# Altium schematic sheet Main.SchDoc
size A3; PageSetup: Record=PageOptions|CenterHorizontal=True|CenterVertical=True|PrintScale=0.67|XCorrection=1.00|YCorrection=1.00|PrintKind=2|BorderSize=5000000|LeftOffset=0|BottomOffset=0|Orientation=2|PaperLength=2970|PaperWidth=2100|Scale=100|PaperSource=7|PrintQuality=300|MediaType=1|DitherType=2|PrintScaleMode=1|PaperKind=A4|PaperIndex=9; Scale: 1:1; DocumentType: Схема электрическая принципиальная; FirstReferrence: АБВГ.123456.001
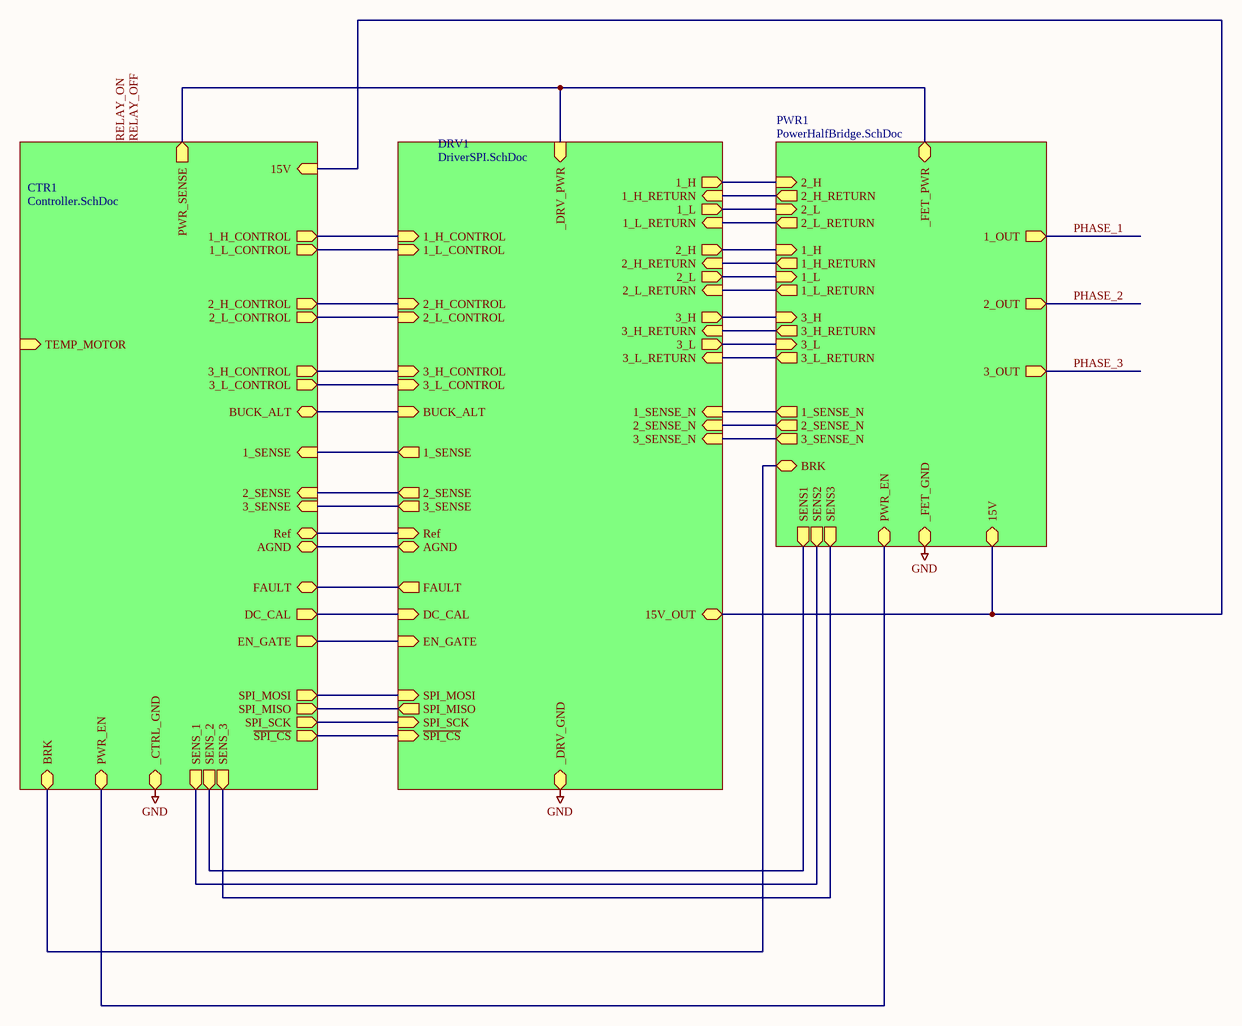
[diagram p0: Main.SchDoc]

## Sub-sheets
CTR1 = Controller.SchDoc: FAULT, 1_L_CONTROL (out), 2_L_CONTROL (out), 3_L_CONTROL (out), DC_CAL (out), SPI_SCK (out), PWR_SENSE (out), 3_H_CONTROL (out), 2_H_CONTROL (out), 1_H_CONTROL (out), SPI_MOSI (out), ~{SPI_CS} (out), 1_SENSE (in), 2_SENSE (in), 15V (in), EN_GATE (out), _CTRL_GND, Ref, AGND, SPI_MISO (out), SENS_1 (out), SENS_2 (out), SENS_3 (out), TEMP_MOTOR (in), BRK, 3_SENSE (in), BUCK_ALT, PWR_EN
DRV1 = DriverSPI.SchDoc: 2_H (out), 1_H (out), 3_H (out), 2_L (out), 1_L (out), 3_L (out), 2_SENSE_N (in), 1_SENSE_N (in), 3_SENSE_N (in), 2_H_RETURN (in), 2_L_RETURN (in), 1_H_RETURN (in), 3_H_RETURN (in), 1_L_RETURN (in), 3_L_RETURN (in), 2_H_CONTROL (in), 2_L_CONTROL (in), 1_H_CONTROL (in), 1_L_CONTROL (in), 3_H_CONTROL (in), 3_L_CONTROL (in), 1_SENSE (out), 2_SENSE (out), _DRV_PWR (in), _DRV_GND (bidir), Ref (in), AGND (bidir), 15V_OUT, FAULT (out), EN_GATE (in), DC_CAL (in), SPI_MOSI (in), SPI_MISO (out), ~{SPI_CS} (in), SPI_SCK (in), 3_SENSE (out), BUCK_ALT (in)
PWR1 = PowerHalfBridge.SchDoc: 1_H (in), 2_H (in), 3_H (in), 1_L (in), 2_L (in), 3_L (in), 1_SENSE_N (out), 2_SENSE_N (out), 3_SENSE_N (out), _FET_PWR, _FET_GND, 1_OUT (out), 2_OUT (out), 3_OUT (out), 1_H_RETURN (out), 1_L_RETURN (out), 2_H_RETURN (out), 3_H_RETURN (out), 2_L_RETURN (out), 3_L_RETURN (out), SENS1 (out), SENS2 (out), SENS3 (out), 15V, BRK, PWR_EN

## Nets
GND: sheet PWR1/_FET_GND, sheet DRV1/_DRV_GND, sheet CTR1/_CTRL_GND
PHASE_1: sheet PWR1/1_OUT
PHASE_2: sheet PWR1/2_OUT
PHASE_3: sheet PWR1/3_OUT
(unnamed): sheet PWR1/1_H, sheet DRV1/2_H
(unnamed): sheet PWR1/2_H, sheet DRV1/1_H
(unnamed): sheet PWR1/3_H, sheet DRV1/3_H
(unnamed): sheet PWR1/1_L, sheet DRV1/2_L
(unnamed): sheet PWR1/2_L, sheet DRV1/1_L
(unnamed): sheet PWR1/3_L, sheet DRV1/3_L
(unnamed): sheet PWR1/1_SENSE_N, sheet DRV1/1_SENSE_N
(unnamed): sheet PWR1/2_SENSE_N, sheet DRV1/2_SENSE_N
(unnamed): sheet PWR1/3_SENSE_N, sheet DRV1/3_SENSE_N
(unnamed): sheet PWR1/_FET_PWR, sheet DRV1/_DRV_PWR, sheet CTR1/PWR_SENSE
(unnamed): sheet PWR1/1_H_RETURN, sheet DRV1/2_H_RETURN
(unnamed): sheet PWR1/1_L_RETURN, sheet DRV1/2_L_RETURN
(unnamed): sheet PWR1/2_H_RETURN, sheet DRV1/1_H_RETURN
(unnamed): sheet PWR1/3_H_RETURN, sheet DRV1/3_H_RETURN
(unnamed): sheet PWR1/2_L_RETURN, sheet DRV1/1_L_RETURN
(unnamed): sheet PWR1/3_L_RETURN, sheet DRV1/3_L_RETURN
(unnamed): sheet PWR1/SENS1, sheet CTR1/SENS_2
(unnamed): sheet PWR1/SENS2, sheet CTR1/SENS_1
(unnamed): sheet PWR1/SENS3, sheet CTR1/SENS_3
(unnamed): sheet PWR1/15V, sheet DRV1/15V_OUT, sheet CTR1/15V
(unnamed): sheet PWR1/BRK, sheet CTR1/BRK
(unnamed): sheet PWR1/PWR_EN, sheet CTR1/PWR_EN
(unnamed): sheet DRV1/2_H_CONTROL, sheet CTR1/2_H_CONTROL
(unnamed): sheet DRV1/2_L_CONTROL, sheet CTR1/2_L_CONTROL
(unnamed): sheet DRV1/1_H_CONTROL, sheet CTR1/1_H_CONTROL
(unnamed): sheet DRV1/1_L_CONTROL, sheet CTR1/1_L_CONTROL
(unnamed): sheet DRV1/3_H_CONTROL, sheet CTR1/3_H_CONTROL
(unnamed): sheet DRV1/3_L_CONTROL, sheet CTR1/3_L_CONTROL
(unnamed): sheet DRV1/1_SENSE, sheet CTR1/1_SENSE
(unnamed): sheet DRV1/2_SENSE, sheet CTR1/2_SENSE
(unnamed): sheet DRV1/Ref, sheet CTR1/Ref
(unnamed): sheet DRV1/AGND, sheet CTR1/AGND
(unnamed): sheet DRV1/FAULT, sheet CTR1/FAULT
(unnamed): sheet DRV1/EN_GATE, sheet CTR1/EN_GATE
(unnamed): sheet DRV1/DC_CAL, sheet CTR1/DC_CAL
(unnamed): sheet DRV1/SPI_MOSI, sheet CTR1/SPI_MOSI
(unnamed): sheet DRV1/SPI_MISO, sheet CTR1/SPI_MISO
(unnamed): sheet DRV1/~{SPI_CS}, sheet CTR1/~{SPI_CS}
(unnamed): sheet DRV1/SPI_SCK, sheet CTR1/SPI_SCK
(unnamed): sheet DRV1/3_SENSE, sheet CTR1/3_SENSE
(unnamed): sheet DRV1/BUCK_ALT, sheet CTR1/BUCK_ALT

## Notes on the sheet
- Labels drawn without touching a wire or pin: RELAY_OFF, RELAY_ON
- Title
- Size:
- Date:
- A3
- Number:
- Time:
- Revision:
- Sheet
- of
- File: